# EAGLE design STM32F100 Base Wireless (EAGLE 6.5.0)
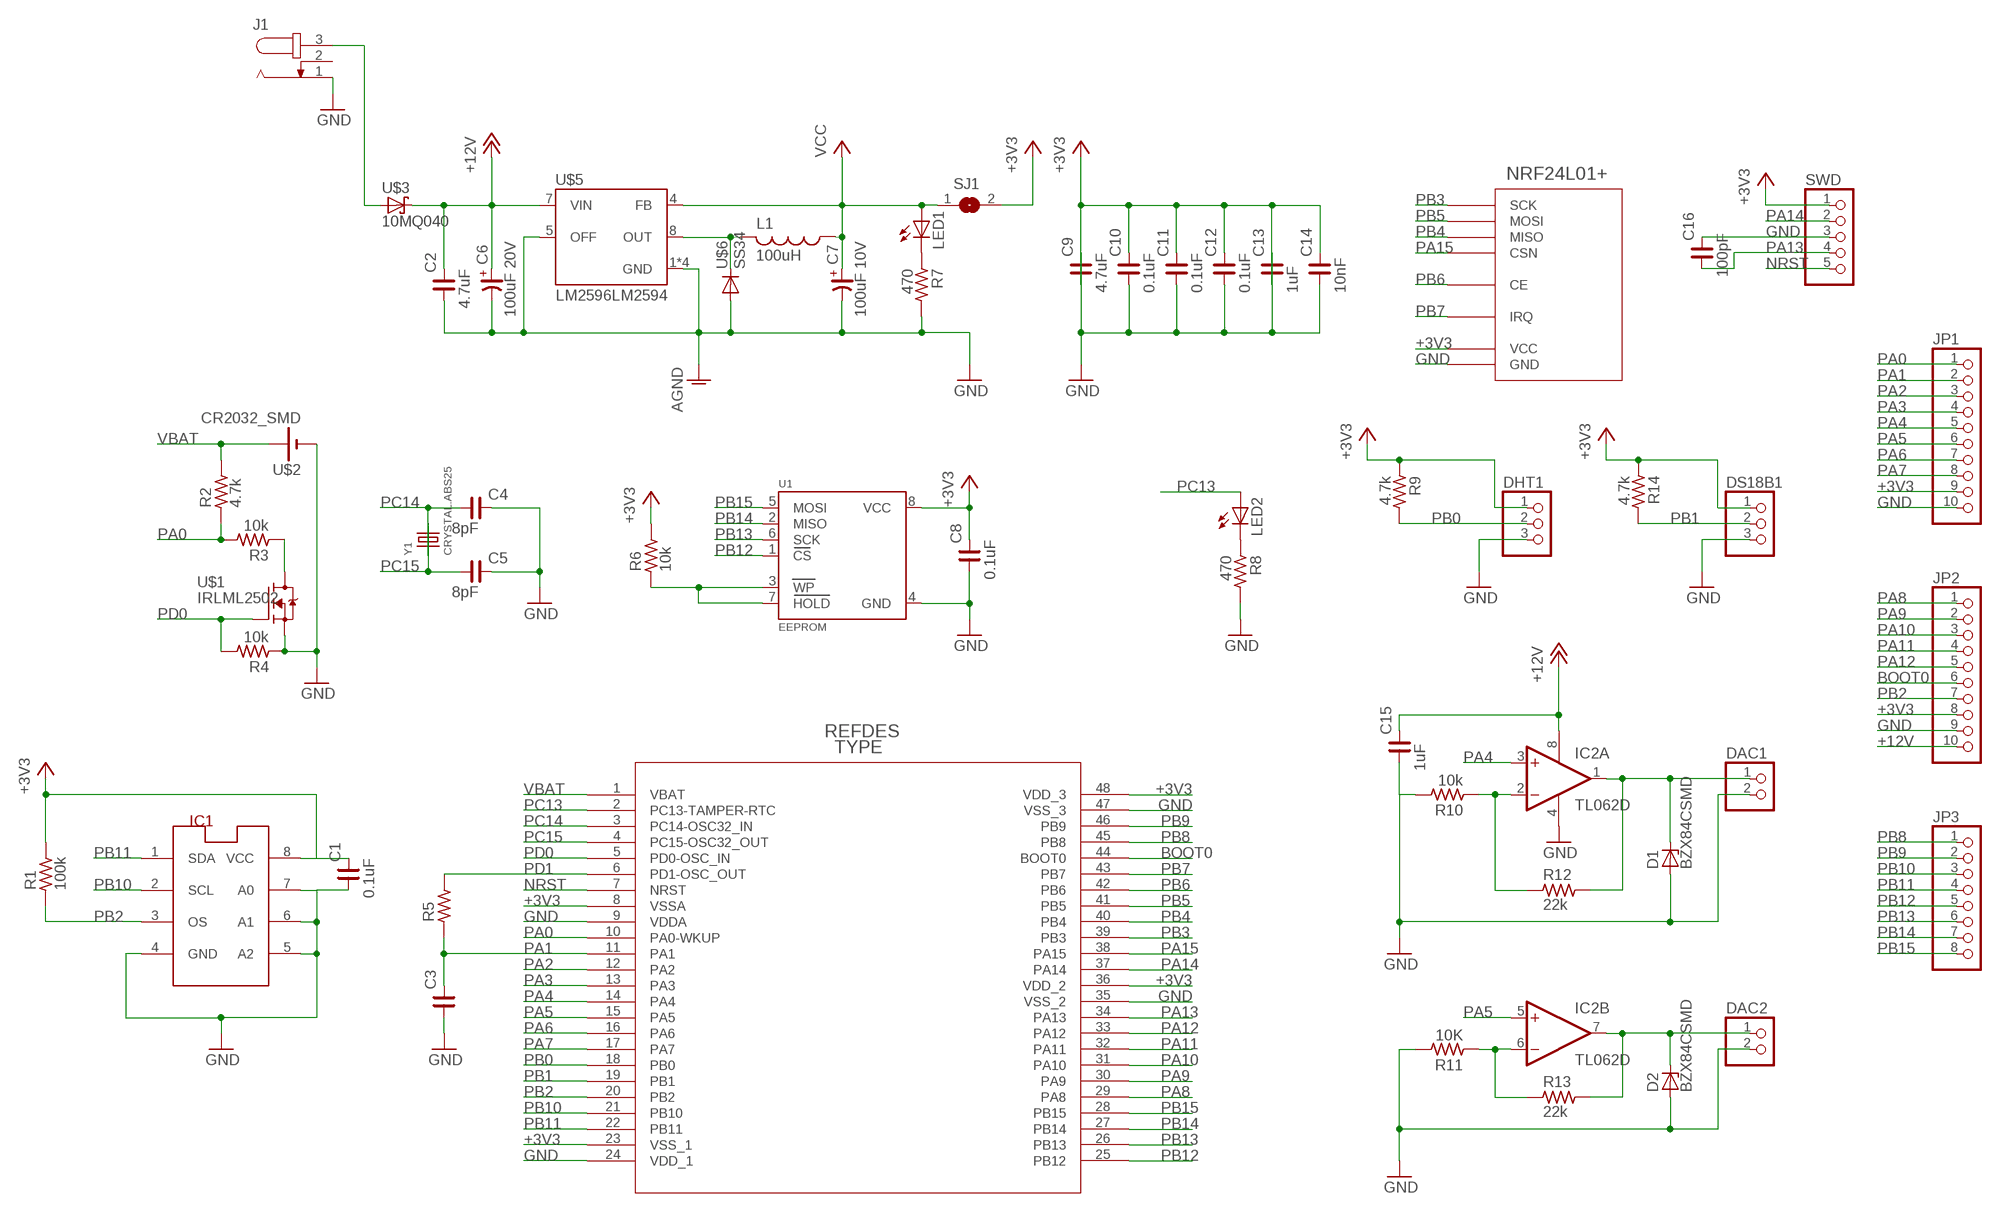
[diagram p0: schematic, sheet 1]

## Parts
C1  0.1uF  C_1206  [C1206]
C2  4.7uF  C_1206  [C1206]
C3  C_1206  [C1206]
C4  8pF  C_0603  [C0603]
C5  8pF  C_0603  [C0603]
C6  100uF 20V  CP_7343  [C7343/T]
C7  100uF 10V  CP_6032-28  [C6032-28/T]
C8  0.1uF  C_1206  [C1206]
C9  4.7uF  C_1206  [C1206]
C10  0.1uF  C_0603  [C0603]
C11  0.1uF  C_0603  [C0603]
C12  0.1uF  C_0603  [C0603]
C13  1uF  C_1206  [C1206]
C14  10nF  C_0603  [C0603]
C15  1uF  C_1206  [C1206]
C16  100pF  C_1206  [C1206]
D1  BZX84CSMD  [TO236]
D2  BZX84CSMD  [TO236]
DAC1  PINHD-1X02_2.54-S  [1X02-S]
DAC2  PINHD-1X02_2.54-S  [1X02-S]
DHT1  PINHD-1X03_2.54-S  [1X03-S]
DS18B1  PINHD-1X03_2.54-S  [1X03-S]
IC1  LM75_ICN  [SO8_LM75]
IC2  TL062D  [SO08]
J1  JACK-PLUG0  [SPC4077]
JP1  PINHD-1X10_2.54-S  [1X10-S]
JP2  PINHD-1X10_2.54-S  [1X10-S]
JP3  PINHD-1X08_2.54-S  [1X08-S]
L1  100uH  L-USWE-TPC  [POWER-CHOKE_WE-TPC]
LED1  LEDCHIPLED_1206  [CHIPLED_1206]
LED2  LEDCHIPLED_1206  [CHIPLED_1206]
R1  100k  R_1206  [R1206]
R2  4.7k  R_1206  [R1206]
R3  10k  R_1206  [R1206]
R4  10k  R_1206  [R1206]
R5  R_1206  [R1206]
R6  10k  R_1206  [R1206]
R7  470  R_1206  [R1206]
R8  470  R_1206  [R1206]
R9  4.7k  R_1206  [R1206]
R10  10k  R_1206  [R1206]
R11  10K  R_1206  [R1206]
R12  22k  R_1206  [R1206]
R13  22k  R_1206  [R1206]
R14  4.7k  R_1206  [R1206]
SJ1  SJ  [SJ]
SWD  PINHD-1X05_2.54-90°-S  [1X05/90-S]
U1  EEPROM  EEPROM_SPI_AT25040A  [SOIC8_150MIL]
U$1  IRLML2502  [SOT23]
U$2  CR2032_SMD  [SMD_BH-2]
U$3  10MQ040  [SMA]
U$4  STM32F100C8T6B  [LQFP-48]
U$5  LM2596LM2594  [SOIC8_150MIL]
U$6  SS34  DIODE-DO214AC  [DO214AC]
U$7  NRF24L01+  [NRF24L01+]
Y1  CRYSTAL.ABS25  [ABS25]

## Nets
+3V3: C1.2 C8.2 C9.1 C10.2 C11.2 C12.2 C13.1 C14.2 DHT1.1 DS18B1.1 IC1.8(VCC) JP1.9 JP2.8 R1.2 R6.2 R9.1 R14.1 SJ1.2 SWD.1 U1.8(VCC) U$4.8(VSSA) U$4.23(VSS_1) U$4.36(VDD_2) U$4.48(VDD_3) U$7.VCC
+12V: C2.2 C6.+ C15.2 IC2.8(P:V+) JP2.10 U$3.C U$5.7(VIN)
BOOT0: JP2.6 U$4.44(BOOT0)
GND: C1.1 C2.1 C3.1 C4.2 C5.2 C6.- C7.- C8.1 C9.2 C10.1 C11.1 C12.1 C13.2 C14.1 C15.1 C16.2 D1.A D2.A DAC1.2 DAC2.2 DHT1.3 DS18B1.3 IC1.4(GND) IC1.5(A2) IC1.6(A1) IC1.7(A0) IC2.4(P:V-) J1.1 JP1.10 JP2.9 R4.1 R7.2 R8.2 R10.2 R11.2 SWD.3 U1.4(GND) U$1.2(S) U$2.P$NEG(-) U$4.9(VDDA) U$4.24(VDD_1) U$4.35(VSS_2) U$4.47(VSS_3) U$5.1(GND) U$5.2(GND) U$5.3(GND) U$5.5(OFF) U$5.6(GND) U$6.A U$7.GND ; supply symbol labelled AGND
IN_12V: J1.3 U$3.A
LM_OUT: L1.2 U$5.8(OUT) U$6.C
LM_VCC: C7.+ L1.1 LED1.A SJ1.1 U$5.4(FB) ; supply symbol labelled VCC
N$1: D1.C DAC1.1 IC2.1(A:OUT) R12.2
N$2: LED1.C R7.1
N$3: IC2.2(A:-IN) R10.1 R12.1
N$4: IC2.6(B:-IN) R11.1 R13.1
N$5: D2.C DAC2.1 IC2.7(B:OUT) R13.2
N$6: R3.1 U$1.3(D)
N$7: LED2.C R8.1
N$10: R6.1 U1.3(WP) U1.7(HOLD)
NRST: SWD.5 U$4.7(NRST)
PA0: JP1.1 R2.1 R3.2 U$4.10(PA0-WKUP)
PA1: C3.2 JP1.2 R5.1 U$4.11(PA1)
PA2: JP1.3 U$4.12(PA2)
PA3: JP1.4 U$4.13(PA3)
PA4: IC2.3(A:+IN) JP1.5 U$4.14(PA4)
PA5: IC2.5(B:+IN) JP1.6 U$4.15(PA5)
PA6: JP1.7 U$4.16(PA6)
PA7: JP1.8 U$4.17(PA7)
PA8: JP2.1 U$4.29(PA8)
PA9: JP2.2 U$4.30(PA9)
PA10: JP2.3 U$4.31(PA10)
PA11: JP2.4 U$4.32(PA11)
PA12: JP2.5 U$4.33(PA12)
PA13: C16.1 SWD.4 U$4.34(PA13)
PA14: SWD.2 U$4.37(PA14)
PA15: U$4.38(PA15) U$7.CSN
PB0: DHT1.2 R9.2 U$4.18(PB0)
PB1: DS18B1.2 R14.2 U$4.19(PB1)
PB2: IC1.3(OS) JP2.7 R1.1 U$4.20(PB2)
PB3: U$4.39(PB3) U$7.SCK
PB4: U$4.40(PB4) U$7.MISO
PB5: U$4.41(PB5) U$7.MOSI
PB6: U$4.42(PB6) U$7.CE
PB7: U$4.43(PB7) U$7.IRQ
PB8: JP3.1 U$4.45(PB8)
PB9: JP3.2 U$4.46(PB9)
PB10: IC1.2(SCL) JP3.3 U$4.21(PB10)
PB11: IC1.1(SDA) JP3.4 U$4.22(PB11)
PB12: JP3.5 U1.1(CS) U$4.25(PB12)
PB13: JP3.6 U1.6(SCK) U$4.26(PB13)
PB14: JP3.7 U1.2(MISO) U$4.27(PB14)
PB15: JP3.8 U1.5(MOSI) U$4.28(PB15)
PC13: LED2.A U$4.2(PC13-TAMPER-RTC)
PC14: C4.1 U$4.3(PC14-OSC32_IN) Y1.1
PC15: C5.1 U$4.4(PC15-OSC32_OUT) Y1.4
PD0: R4.2 U$1.1(G) U$4.5(PD0-OSC_IN)
PD1: R5.2 U$4.6(PD1-OSC_OUT)
VBAT: R2.2 U$2.P$POS1(+) U$4.1(VBAT)
Unconnected: J1.2

## Library data of the parts
C1-C5 C8-C16 = rc-master-smd:C_: NON-POLARIZED CAP
C6 C7 = rc-master-smd:CP_: POLARIZED CAP
D1 D2 = diode:BZX84CSMD: Z DIODE
DAC1 DAC2 = pinhead-2:PINHD-1X02: PIN HEADER
DHT1 DS18B1 = pinhead-2:PINHD-1X03: PIN HEADER
IC1 = lm75:LM75_IC: Temperatursensor
IC2 = linear:TL062: OP AMP
J1 = con-jack:JACK-PLUG: DC POWER JACK Power Jack, DC, Right Angle, Through Hole, Rated 5A at 16VDC, PC Terminals Distributor: Farnell (www.Farnell.de) Drawing: 84N1161.pdf / 84N1162.pdf Manufacturer: SPC Technology (www.spctechnology.com) Type: SPC4077 / SPC 4078; OC_FARNELL: unknown; OC_NEWARK: unknown
JP1 JP2 = pinhead-2:PINHD-1X10: PIN HEADER
JP3 = pinhead-2:PINHD-1X08: PIN HEADER
L1 = rcl:L-US: INDUCTOR, American symbol; SDR0604-470KL: 47uH
LED1 LED2 = led:LED: LED OSRAM: - CHIPLED LG R971, LG N971, LY N971, LG Q971, LY Q971, LO R971, LY R971 LH N974, LH R974 LS Q976, LO Q976, LY Q976 LO Q996 - Hyper CHIPLED LW Q18S LB Q993, LB Q99A, LB R99A - SideLED LS A670, LO A670, LY A670, LG A670, LP A670 LB A673, LV A673, LT A673, LW A673 LH A674 LY A675 LS A676, LA A676, LO A676, LY A676, LW A676 LS A679, LY A679, LG A679 - Hyper Micro SIDELED® LS Y876, LA Y876, LO Y876, LY Y876 LT Y87S - SmartLED LW L88C, LW L88S LB L89C, LB L89S, LG L890 LS L89K, LO L89K, LY L89K LS L896, LA L896, LO L896, LY L896 - TOPLED LS T670, LO T670, LY T670, LG T670, LP T670 LSG T670, LSP T670, LSY T670, LOP T670, LYG T670 LG T671, LOG T671, LSG T671 LB T673, LV T673, LT T673, LW T673 LH T674 LS T676, LA T676, LO T676, LY T676, LB T676, LH T676, LSB T676, LW T676 LB T67C, LV T67C, LT T67C, LS T67K, LO T67K, LY T67K, LW E67C LS E67B, LA E67B, LO E67B, LY E67B, LB E67C, LV E67C, LT E67C LW T67C LS T679, LY T679, LG T679 LS T770, LO T770, LY T770, LG T770, LP T770 LB T773, LV T773, LT T773, LW T773 LH T774 LS E675, LA E675, LY E675, LS T675 LS T776, LA T776, LO T776, LY T776, LB T776 LHGB T686 LT T68C, LB T68C - Hyper Mini TOPLED® LB M676 - Mini TOPLED Santana® LG M470 LS M47K, LO M47K, LY M47K Source: http://www.osram.convergy.de LUXEON: - LUMILED® LXK2-PW12-R00, LXK2-PW12-S00, LXK2-PW14-U00, LXK2-PW14-V00 LXK2-PM12-R00, LXK2-PM12-S00, LXK2-PM14-U00 LXK2-PE12-Q00, LXK2-PE12-R00, LXK2-PE12-S00, LXK2-PE14-T00, LXK2-PE14-U00 LXK2-PB12-K00, LXK2-PB12-L00, LXK2-PB12-M00, LXK2-PB14-N00, LXK2-PB14-P00, LXK2-PB14-Q00 LXK2-PR12-L00, LXK2-PR12-M00, LXK2-PR14-Q00, LXK2-PR14-R00 LXK2-PD12-Q00, LXK2-PD12-R00, LXK2-PD12-S00 LXK2-PH12-R00, LXK2-PH12-S00 LXK2-PL12-P00, LXK2-PL12-Q00, LXK2-PL12-R00 Source: www.luxeon.com KINGBRIGHT: KA-3528ASYC Source: www.kingbright.com
R1-R14 = rc-master-smd:R_: RESISTOR
SJ1 = jumper:SJ: SMD solder JUMPER
SWD = pinhead-2:PINHD-1X05: PIN HEADER
U1 = my-library:EEPROM_SPI_AT25040A: AT25010a/40a EEPROM SOIC8 AT25010a, 1K (128 x 8 bit) - Digikey: AT25010AN-10SU2.7-ND AT25040a, 4K (256 x 8 bit) - Digikey: AT25040AN-10SU1.8-ND TSSOP8 AT25010a, 1K (128 x 8 bit) - Digikey: AT25010A-10TU-1.8-ND AT25040a, 4K (256 x 8 bit) - Digikey: AT25040A-10TU-1.8-ND
U$1 = my-library:IRLML2502
U$2 = my-library:CR2032_SMD
U$3 = my-library:10MQ040: SCHOTTKY
U$4 = STM32F1:STM32F100C8T6B
U$5 = my-library:LM2596: LM2596
U$6 = diode:DIODE-: DIODE
U$7 = my-library:NRF24L01+: NRF24L01+ wireless data transmission module 2.4G
Y1 = abracon:CRYSTAL

## Board
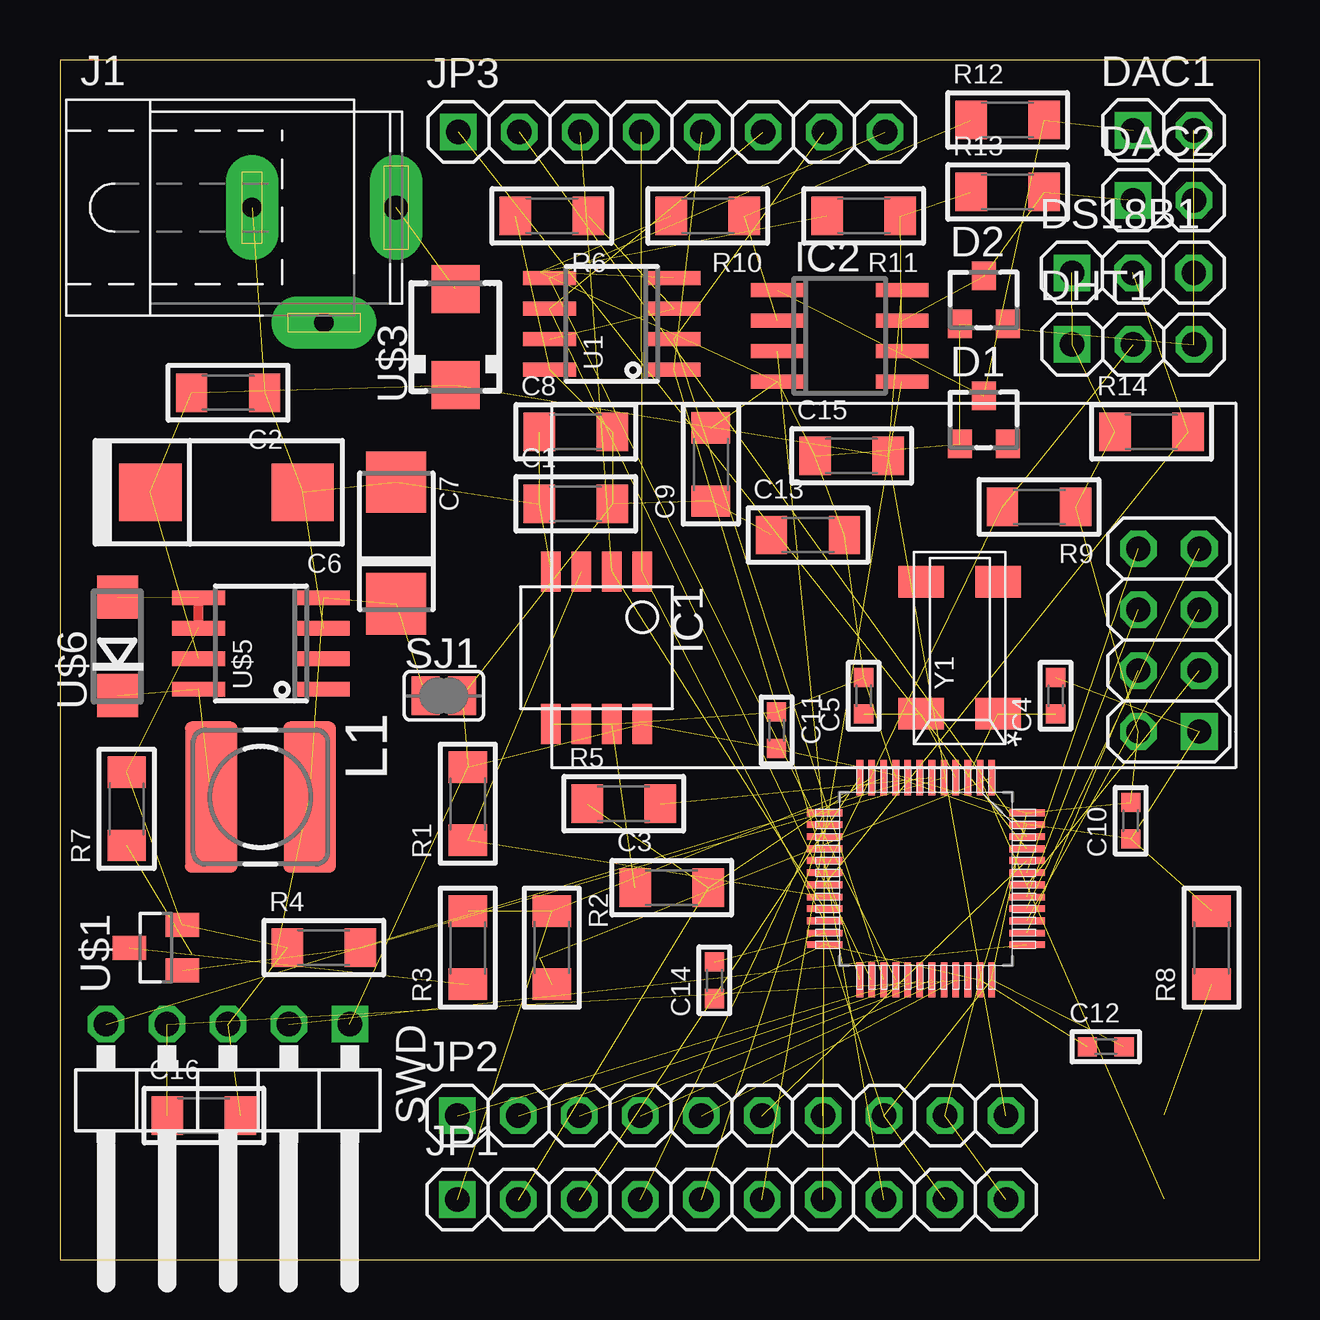
[diagram p1: board, top side]
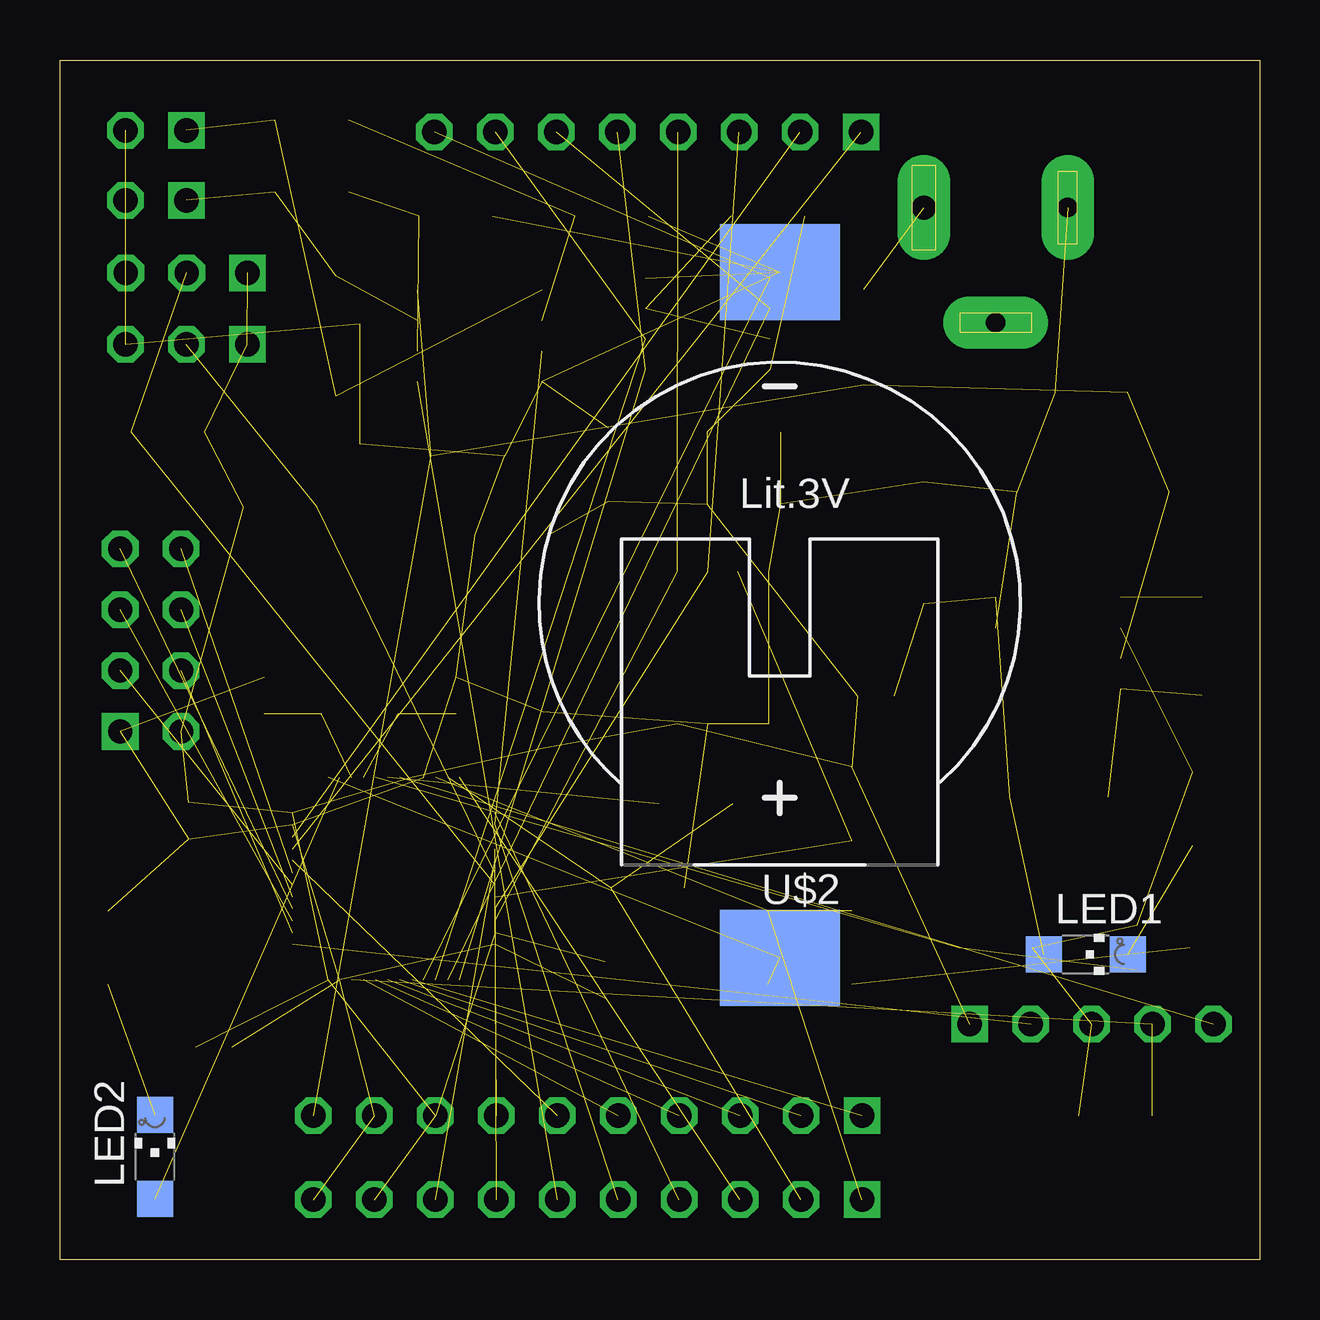
[diagram p2: board, bottom side, seen from below]

Size 50 x 50 mm. Coordinates in mm from the lower left corner, seen from the top.
Outline: 0,0 50,0 50,50 0,50 0,0
Copper layers (1*16): Top 0.035mm / dielectric 1.5mm / Bottom 0.035mm
Design rules "default": minimum track width 10mil, minimum drill 24mil, track to track 8mil, track to pad 8mil, pad to pad 8mil, via to via 8mil, smd to smd 8mil, copper to edge 40mil, drill to drill 8mil, minimum pad ring 10mil, minimum via ring 8mil, stop-mask expansion 4mil, vias tented up to drill 0mil, thermal gap 10mil

### Footprints (pad centres in the part's own frame; a part is rotated, then mirrored left to right if it is on the bottom)
C1206 = smd 1.3 x 1.6: 1 -1.524,0; 2 1.524,0
C0603 = smd 0.8 x 0.8: 1 -0.762,0; 2 0.762,0
C7343/T = smd 2.6 x 2.4: + 3.175,0; - -3.175,0
C6032-28/T = smd 2.55 x 2.5: + 2.54,0; - -2.54,0
TO236 = smd 1 x 1.2: A -1,-1; C 0,1; NC 1,-1
1X02-S = drill 1.016 square: 1 -1.27,0 | drill 1.016 octagon: 2 1.27,0
1X03-S = drill 1.016 square: 1 -2.54,0 | drill 1.016 octagon: 2 0,0; 3 2.54,0
SO8_LM75 = smd 0.813 x 1.676: 1 -1.27,-3.175; 2 0,-3.175; 3 1.27,-3.175; 4 2.54,-3.175; 5 2.54,3.175; 6 1.27,3.175; 7 0,3.175; 8 -1.27,3.175
SO08 = smd 0.6 x 2.2: 1 -1.905,-2.6; 2 -0.635,-2.6; 3 0.635,-2.6; 4 1.905,-2.6; 5 1.905,2.6; 6 0.635,2.6; 7 -0.635,2.6; 8 -1.905,2.6
SPC4077 = drill 0.8 pad 2.184 long: 1 -3,0; 2 0,-4.8 | drill 1 pad 2.184 long: 3 3,0
1X10-S = drill 1.016 square: 1 -11.43,0 | drill 1.016 octagon: 2 -8.89,0; 3 -6.35,0; 4 -3.81,0; 5 -1.27,0; 6 1.27,0; 7 3.81,0; 8 6.35,0; 9 8.89,0; 10 11.43,0
1X08-S = drill 1.016 square: 1 -8.89,0 | drill 1.016 octagon: 2 -6.35,0; 3 -3.81,0; 4 -1.27,0; 5 1.27,0; 6 3.81,0; 7 6.35,0; 8 8.89,0
POWER-CHOKE_WE-TPC = smd 6.3 x 2.2: 1 0,2.05; 2 0,-2.05
CHIPLED_1206 = smd 1.5 x 1.5: A 0,-1.75; C 0,1.75
R1206 = smd 1.3 x 1.6: 1 -1.524,0; 2 1.524,0
SJ = smd 1.168 x 1.6: 1 -0.762,0; 2 0.762,0
1X05/90-S = drill 1.016 square: 1 -5.08,-3.81 | drill 1.016 octagon: 2 -2.54,-3.81; 3 0,-3.81; 4 2.54,-3.81; 5 5.08,-3.81
SOIC8_150MIL = smd 0.6 x 2.2: 1 -1.905,-2.6; 2 -0.635,-2.6; 3 0.635,-2.6; 4 1.905,-2.6; 5 1.905,2.6; 6 0.635,2.6; 7 -0.635,2.6; 8 -1.905,2.6
SOT23 = smd 1 x 1.4: 1 -0.95,-1.1; 2 0.95,-1.1; 3 0,1.1
SMD_BH-2 = smd 5 x 4: P$NEG 0,-13.652; P$POS1 0,14.922
SMA = smd 2 x 2: A 2,0; C -2,0
LQFP-48 = smd 1.473 x 0.279: 1 -4.216,2.743; 2 -4.216,2.261; 3 -4.216,1.753; 4 -4.216,1.245; 5 -4.216,0.762; 6 -4.216,0.254; 7 -4.216,-0.254; 8 -4.216,-0.762; 9 -4.216,-1.245; 10 -4.216,-1.753; 11 -4.216,-2.261; 12 -4.216,-2.743; 25 4.216,-2.743; 26 4.216,-2.261; 27 4.216,-1.753; 28 4.216,-1.245; 29 4.216,-0.762; 30 4.216,-0.254; 31 4.216,0.254; 32 4.216,0.762; 33 4.216,1.245; 34 4.216,1.753; 35 4.216,2.261; 36 4.216,2.743 | smd 0.279 x 1.473: 13 -2.743,-4.216; 14 -2.261,-4.216; 15 -1.753,-4.216; 16 -1.245,-4.216; 17 -0.762,-4.216; 18 -0.254,-4.216; 19 0.254,-4.216; 20 0.762,-4.216; 21 1.245,-4.216; 22 1.753,-4.216; 23 2.261,-4.216; 24 2.743,-4.216; 37 2.743,4.216; 38 2.261,4.216; 39 1.753,4.216; 40 1.245,4.216; 41 0.762,4.216; 42 0.254,4.216; 43 -0.254,4.216; 44 -0.762,4.216; 45 -1.245,4.216; 46 -1.753,4.216; 47 -2.261,4.216; 48 -2.743,4.216
DO214AC = smd 1.8 x 1.7: A 2.05,0; C -2.05,0
NRF24L01+ = drill 1.016 octagon: CE -1.51,4.05; CSN -4.05,4.05; IRQ -4.05,9.13; MISO -1.51,9.13; MOSI -4.05,6.59; SCK -1.51,6.59; VCC -4.05,1.51 | drill 1.016 square: GND -1.51,1.51
ABS25 = smd 1.3 x 1.9: 1 -2.75,-1.6; 2 2.75,-1.6; 3 2.75,1.6; 4 -2.75,1.6

### Placement (x,y rotation side)
C1  21.5,31.5 0 top
C2  7.01,36.13 180 top
C3  25.5,15.5 0 top
C4  41.5,23.5 90 top
C5  33.5,23.5 90 top
C6  6.94,31.98 180 top
C7  14.02,29.87 270 top
C8  21.5,34.5 0 top
C9  27.13,33.14 90 top
C10  44.63,18.29 90 top
C11  29.87,22.06 270 top
C12  43.59,8.87 0 top
C13  31.18,30.2 0 top
C14  27.28,11.64 90 top
C15  33,33.5 0 top
C16  6,6 0 top
D1  38.5,35 0 top
D2  38.5,40 0 top
DAC1  46,47.07 0 top
DAC2  46,44.15 0 top
DHT1  44.73,38.14 0 top
DS18B1  44.72,41.13 0 top
IC1  23,25.5 180 top
IC2  32.5,38.5 270 top
J1  11,43.85 0 top
JP1  28,2.5 0 top
JP2  28,6 0 top
JP3  25.5,47 0 top
L1  8.36,19.28 270 top
LED1  7.25,12.72 270 bottom
LED2  46.04,4.29 0 bottom
R1  17,19 90 top
R2  20.5,13 270 top
R3  17,13 90 top
R4  11,13 0 top
R5  23.5,19 0 top
R6  20.5,43.5 180 top
R7  2.78,18.79 90 top
R8  48,13 90 top
R9  40.81,31.37 180 top
R10  27,43.5 180 top
R11  33.5,43.5 180 top
R12  39.5,47.5 0 top
R13  39.5,44.5 0 top
R14  45.5,34.5 0 top
SJ1  16,23.5 0 top
SWD  7,6 180 top
U1  23,39 90 top
U$1  4,13 90 top
U$2  20,27.5 180 bottom
U$3  16.48,38.45 90 top
U$4  36.09,15.87 270 top
U$5  8.38,25.68 90 top
U$6  2.41,25.56 90 top
U$7  49,20.5 0 top
Y1  37.5,25.5 90 top

### Tracks (layer width: path | path; a pad name or v marks a point on that pad's centre or on a via)
+3V3  (24 unrouted)
+12V  (6 unrouted)
BOOT0  (1 unrouted)
GND  (45 unrouted)
  Top 0.406: U$5.6 U$5.5
IN_12V  (1 unrouted)
LM_OUT  (2 unrouted)
LM_VCC  (4 unrouted)
N$1  (3 unrouted)
N$2  (1 unrouted)
N$3  (2 unrouted)
N$4  (2 unrouted)
N$5  (3 unrouted)
N$6  (1 unrouted)
N$7  (1 unrouted)
N$10  (2 unrouted)
NRST  (1 unrouted)
PA0  (3 unrouted)
PA1  (3 unrouted)
PA2  (1 unrouted)
PA3  (1 unrouted)
PA4  (2 unrouted)
PA5  (2 unrouted)
PA6  (1 unrouted)
PA7  (1 unrouted)
PA8  (1 unrouted)
PA9  (1 unrouted)
PA10  (1 unrouted)
PA11  (1 unrouted)
PA12  (1 unrouted)
PA13  (2 unrouted)
PA14  (1 unrouted)
PA15  (1 unrouted)
PB0  (2 unrouted)
PB1  (2 unrouted)
PB2  (3 unrouted)
PB3  (1 unrouted)
PB4  (1 unrouted)
PB5  (1 unrouted)
PB6  (1 unrouted)
PB7  (1 unrouted)
PB8  (1 unrouted)
PB9  (1 unrouted)
PB10  (2 unrouted)
PB11  (2 unrouted)
PB12  (2 unrouted)
PB13  (2 unrouted)
PB14  (2 unrouted)
PB15  (2 unrouted)
PC13  (1 unrouted)
PC14  (2 unrouted)
PC15  (2 unrouted)
PD0  (2 unrouted)
PD1  (1 unrouted)
VBAT  (2 unrouted)